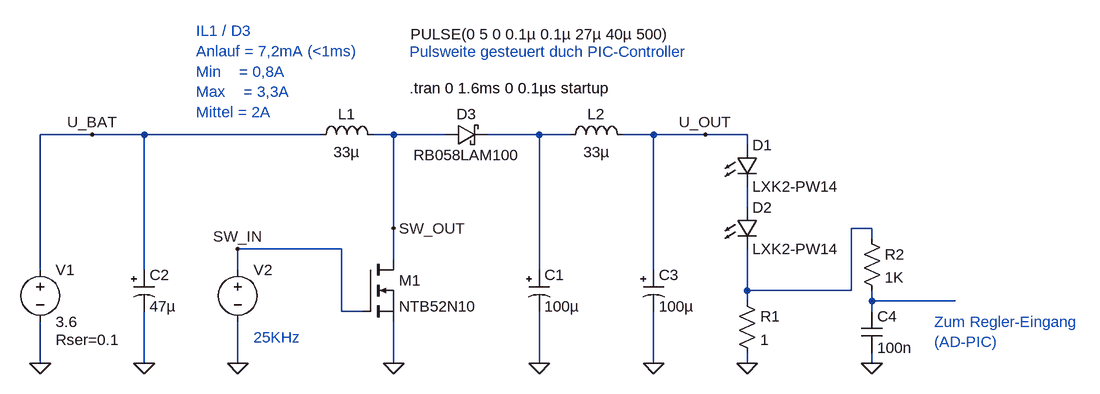
[diagram p0: schematic Boost_Converter.asc]
Boost_Converter.asc, the LTspice schematic file:
Version 4
SHEET 1 1216 680
WIRE -320 176 -400 176
WIRE -240 176 -320 176
WIRE 32 176 -240 176
WIRE 144 176 112 176
WIRE 224 176 144 176
WIRE 368 176 288 176
WIRE 416 176 368 176
WIRE 544 176 496 176
WIRE 624 176 544 176
WIRE 688 176 624 176
WIRE 688 192 688 176
WIRE 688 288 688 256
WIRE 144 320 144 176
WIRE 880 320 848 320
WIRE 880 336 880 320
WIRE 64 352 -96 352
WIRE 144 368 144 320
WIRE -400 384 -400 176
WIRE -240 384 -240 176
WIRE -96 384 -96 352
WIRE 368 384 368 176
WIRE 544 384 544 176
WIRE 688 416 688 352
WIRE 848 416 848 320
WIRE 848 416 688 416
WIRE 688 432 688 416
WIRE 880 432 880 416
WIRE 1008 432 880 432
WIRE 64 448 64 352
WIRE 96 448 64 448
WIRE 880 448 880 432
WIRE -400 528 -400 464
WIRE -240 528 -240 448
WIRE -96 528 -96 464
WIRE 144 528 144 464
WIRE 368 528 368 448
WIRE 544 528 544 448
WIRE 688 528 688 512
WIRE 880 528 880 512
FLAG -400 528 0
FLAG -96 528 0
FLAG 144 528 0
FLAG 688 528 0
FLAG 368 528 0
FLAG -96 352 SW_IN
FLAG 144 320 SW_OUT
FLAG -320 176 U_BAT
FLAG 624 176 U_OUT
FLAG -240 528 0
FLAG 544 528 0
FLAG 880 528 0
SYMBOL voltage -400 368 R0
WINDOW 123 0 0 Left 0
WINDOW 39 24 124 Left 2
SYMATTR SpiceLine Rser=0.1
SYMATTR InstName V1
SYMATTR Value 3.6
SYMBOL LED 672 192 R0
SYMATTR InstName D1
SYMATTR Value LXK2-PW14
SYMATTR Description Diode
SYMATTR Type diode
SYMBOL LED 672 288 R0
SYMATTR InstName D2
SYMATTR Value LXK2-PW14
SYMATTR Description Diode
SYMATTR Type diode
SYMBOL nmos 96 368 R0
SYMATTR InstName M1
SYMATTR Value NTB52N10
SYMBOL voltage -96 368 R0
WINDOW 3 266 -347 Left 2
WINDOW 123 0 0 Left 0
WINDOW 39 0 0 Left 0
SYMATTR Value PULSE(0 5 0 0.1µ 0.1µ 27µ 40µ 500)
SYMATTR InstName V2
SYMBOL polcap 352 384 R0
WINDOW 3 24 56 Left 2
SYMATTR Value 100µ
SYMATTR InstName C1
SYMATTR Description Capacitor
SYMATTR Type cap
SYMATTR SpiceLine V=25 Irms=750m Rser=0.16 Lser=0
SYMBOL ind 16 192 R270
WINDOW 0 32 56 VTop 2
WINDOW 3 5 56 VBottom 2
SYMATTR InstName L1
SYMATTR Value 33µ
SYMATTR SpiceLine Ipk=2.8 Rser=0.2 Rpar=86577.4 Cpar=0
SYMBOL schottky 224 192 R270
WINDOW 0 32 32 VTop 2
WINDOW 3 0 32 VBottom 2
SYMATTR InstName D3
SYMATTR Value RB058LAM100
SYMATTR Description Diode
SYMATTR Type diode
SYMBOL polcap -256 384 R0
WINDOW 3 24 56 Left 2
SYMATTR Value 47µ
SYMATTR InstName C2
SYMATTR Description Capacitor
SYMATTR Type cap
SYMATTR SpiceLine V=25 Irms=750m Rser=0.16 Lser=0
SYMBOL ind 400 192 R270
WINDOW 0 32 56 VTop 2
WINDOW 3 5 56 VBottom 2
SYMATTR InstName L2
SYMATTR Value 33µ
SYMATTR SpiceLine Ipk=2.8 Rser=0.2 Rpar=86577.4 Cpar=0
SYMBOL polcap 528 384 R0
WINDOW 3 24 56 Left 2
SYMATTR Value 100µ
SYMATTR InstName C3
SYMATTR Description Capacitor
SYMATTR Type cap
SYMATTR SpiceLine V=25 Irms=750m Rser=0.16 Lser=0
SYMBOL res 672 416 R0
SYMATTR InstName R1
SYMATTR Value 1
SYMBOL cap 864 448 R0
SYMATTR InstName C4
SYMATTR Value 100n
SYMBOL res 864 320 R0
SYMATTR InstName R2
SYMATTR Value 1K
TEXT 168 104 Left 2 !.tran 0 1.6ms 0 0.1µs startup
TEXT -160 16 Left 2 ;IL1 / D3\nAnlauf = 7,2mA (<1ms)\nMin    = 0,8A\nMax    = 3,3A\nMittel = 2A
TEXT -72 488 Left 2 ;25KHz
TEXT 976 464 Left 2 ;Zum Regler-Eingang\n(AD-PIC)
TEXT 168 48 Left 2 ;Pulsweite gesteuert duch PIC-Controller

The netlist it stands for:
* Boost_Converter.asc
V1 U_BAT 0 3.6 Rser=0.1
D1 U_OUT N002 LXK2-PW14
D2 N002 N003 LXK2-PW14
M1 SW_OUT SW_IN 0 0 NTB52N10
V2 SW_IN 0 PULSE(0 5 0 0.1µ 0.1µ 27µ 40µ 500)
C1 N001 0 100µ V=25 Irms=750m Rser=0.16 Lser=0
L1 U_BAT SW_OUT 33µ Ipk=2.8 Rser=0.2 Rpar=86577.4 Cpar=0
D3 SW_OUT N001 RB058LAM100
C2 U_BAT 0 47µ V=25 Irms=750m Rser=0.16 Lser=0
L2 N001 U_OUT 33µ Ipk=2.8 Rser=0.2 Rpar=86577.4 Cpar=0
C3 U_OUT 0 100µ V=25 Irms=750m Rser=0.16 Lser=0
R1 N003 0 1
C4 N004 0 100n
R2 N003 N004 1K
.model D D
.lib standard.dio
.model NMOS NMOS
.model PMOS PMOS
.lib standard.mos
.tran 0 1.6ms 0 0.1µs startup
* IL1 / D3
* Anlauf = 7,2mA (<1ms)
* Min    = 0,8A
* Max    = 3,3A
* Mittel = 2A
* 25KHz
* Zum Regler-Eingang
* (AD-PIC)
* Pulsweite gesteuert duch PIC-Controller
.backanno
.end

* Results of the author's LTspice run, read from the files saved beside the schematic
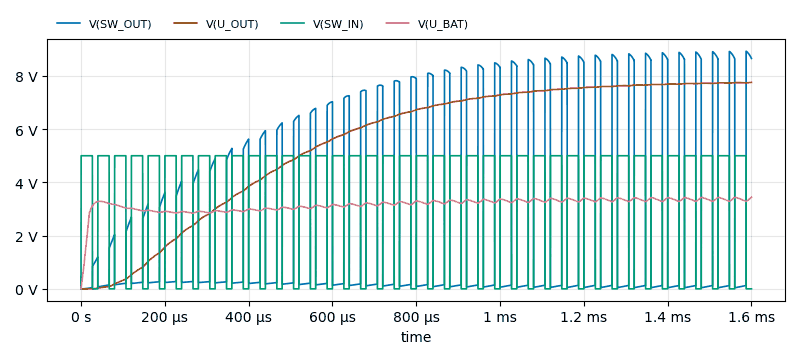
[diagram p1: Transient Analysis of Boost_Converter.asc, plotted from the saved traces]
* Transient Analysis, 1 run:
*   V(SW_OUT): min -32.7 µV, max 8.926 V, average 2.336 V, rms 4.136 V, last 8.655 V
*   V(U_OUT): min 0 V, max 7.754 V, average 5.509 V, rms 6.053 V, last 7.754 V
*   V(SW_IN): min 0 V, max 5 V, average 3.387 V, rms 4.113 V, last 0 V
*   V(U_BAT): min 0 V, max 3.44 V, average 3.165 V, rms 3.178 V, last 3.44 V